# EAGLE schematic schematic (EAGLE 9.3.1)
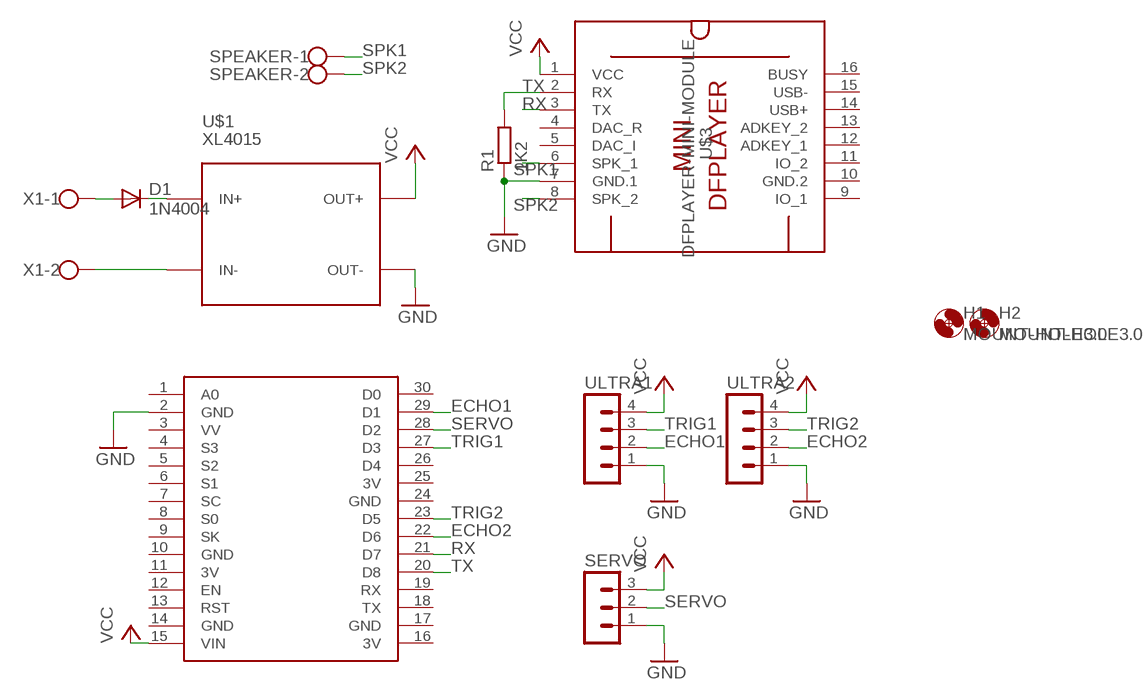
[diagram p0: schematic, sheet 1]

## Parts
D1  1N4004  [DO41-10]
H1  MOUNT-HOLE3.0  [3,0]
H2  MOUNT-HOLE3.0  [3,0]
R1  1K2  R-EU_0204/5  [0204/5]
SERVO  MA03-1  [MA03-1]
SPEAKER  W237-102  [W237-102]
U$1  XL4015  [XL4015]
U$2  NODEMCU  [NODEMCU]
U$3  DFPLAYER-MINI-MODULE  [DFPLAYER-MINI-MODULE]
ULTRA1  MA04-1  [MA04-1]
ULTRA2  MA04-1  [MA04-1]
X1  W237-102  [W237-102]

## Nets
ECHO1: U$2.29(D1) ULTRA1.2
ECHO2: U$2.22(D6) ULTRA2.2
GND: R1.1 SERVO.1 U$1.OUT- U$2.2(GND) U$3.7(GND.1) ULTRA1.1 ULTRA2.1
N$1: D1.C U$1.IN+
N$2: U$1.IN- X1.2
N$3: D1.A X1.1
RX: U$2.21(D7) U$3.3(TX)
SERVO: SERVO.2 U$2.28(D2)
SPK1: SPEAKER.1 U$3.6(SPK_1)
SPK2: SPEAKER.2 U$3.8(SPK_2)
TRIG1: U$2.27(D3) ULTRA1.3
TRIG2: U$2.23(D5) ULTRA2.3
TX: R1.2 U$2.20(D8) U$3.2(RX)
VCC: SERVO.3 U$1.OUT+ U$2.15(VIN) U$3.1(VCC) ULTRA1.4 ULTRA2.4
Unconnected: U$2.1(A0) U$2.3(VV) U$2.4(S3) U$2.5(S2) U$2.6(S1) U$2.7(SC) U$2.8(S0) U$2.9(SK) U$2.12(EN) U$2.13(RST) U$2.18(TX) U$2.19(RX) U$2.26(D4) U$2.30(D0) U$3.4(DAC_R) U$3.5(DAC_I) U$3.9(IO_1) U$3.11(IO_2) U$3.12(ADKEY_1) U$3.13(ADKEY_2) U$3.14(USB+) U$3.15(USB-) U$3.16(BUSY)

## Power pins joined to a net without a drawn wire
3V: U$2.11(3V) U$2.16(3V) U$2.25(3V)
GND: U$2.10(GND) U$2.14(GND) U$2.17(GND) U$2.24(GND)
GND.2: U$3.10(GND.2)

## Library data of the parts
D1 = adafruit:1N4004: DIODE General purpose 1N400x type rectifier (With bigger pads) http://www.ladyada.net/library/pcb/eaglelibrary.html
H1 H2 = holes:MOUNT-HOLE: MOUNTING HOLE with drill center marker
R1 = resistor:R-EU_: RESISTOR, European symbol
SERVO = con-lstb:MA03-1: PIN HEADER; OC_FARNELL: unknown; OC_NEWARK: unknown
SPEAKER X1 = con-wago-500:W237-102: WAGO SCREW CLAMP; MPN: 237-102; OC_FARNELL: unknown; OC_NEWARK: 70K9898
U$1 = xl4015:XL4015: DC/DC Step-Down Regulator based on LM2596-ADJ chip LM2596 datasheet available here: http://www.ti.com/lit/ds/symlink/lm2596.pdf Click here to find device on ebay.com <http://www.ebay.com/sch/lm2596+power+regulator>
U$2 = nodemcu:NODEMCU
U$3 = lm2596:DFPLAYER-MINI-MODULE: DFPlayer Mini - MP3 player module based on YX5200 chip More details available here: https://www.dfrobot.com/wiki/index.php/DFPlayer_Mini_SKU:DFR0299 Click here to find device on ebay.com <http://www.ebay.com/sch/dfplayer+mini>
ULTRA1 ULTRA2 = con-lstb:MA04-1: PIN HEADER; OC_FARNELL: unknown; OC_NEWARK: unknown